# Altium schematic sheet ES.SchDoc
size A
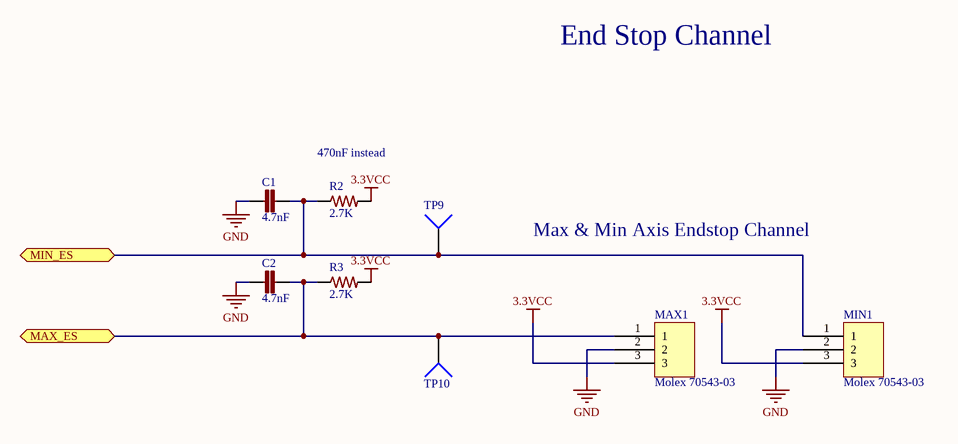
[diagram p0: ES.SchDoc]

## Parts
C1  4.7nF  [C0402]
C2  4.7nF  [C0402]
MAX1  Molex 70543-03  [70543-03]
MIN1  Molex 70543-03  [70543-03]
R2  2.7K  [R0402]
R3  2.7K  [R0402]
TP9  TP4  [TP-2]  (value not drawn)
TP10  TP4  [TP-2]  (value not drawn)

## Ports
MAX_ES, MIN_ES

## Nets
3.3VCC: MAX1.3 MIN1.3 R2.2 R3.2
GND: C1.1 C2.1 MAX1.2 MIN1.2
MAX_ES: C2.2 MAX1.1 R3.1 TP10.1 ; port MAX_ES
MIN_ES: C1.2 MIN1.1 R2.1 TP9.1 ; port MIN_ES

## Notes on the sheet
- End Stop Channel
- 470nF instead
- Max & Min Axis Endstop Channel

## Library data of the parts
C1 C2 = CC0402KRX7R8BB472: CAP CER 0402 4.7nF 25V 10% X7R; LastRevisionNote: ImportComponents; Published: 23-Apr-2014; Publisher: UltiMachine; LastRevisionDate: 23-Apr-2014; ManufacturerPartNumber: CC0402KRX7R8BB472; VALUE: 4.7nF
MAX1 MIN1 = Molex Endstop
R2 R3 = ERJ-2GEJ272X: RES SMD 2.7K OHM 5% 1/10W 0402; LastRevisionNote: ImportComponents; Published: 23-Apr-2014; Publisher: Adam Vadala-Roth; LastRevisionDate: 23-Apr-2014; ManufacturerPartNumber: ERJ-2GEJ272X; Digikey #: P2.7KJCT-ND; Tolerance: 5%; Mounting type: SMD; VALUE: 2.7K
TP9 TP10 = Socket: LatestRevisionDate: 17-Jul-2002; LatestRevisionNote: Re-released for DXP Platform.; Publisher: Altium Limited